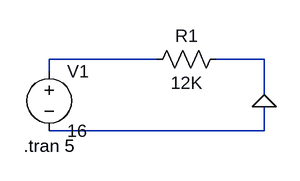
[diagram p0: schematic Draft3.asc]
Draft3.asc, the LTspice schematic file:
Version 4
SHEET 1 880 680
WIRE 80 192 -64 192
WIRE 224 192 160 192
WIRE -64 208 -64 192
WIRE 224 240 224 192
WIRE 224 288 224 256
WIRE 224 288 -64 288
FLAG 224 256 0
SYMBOL res 176 176 R90
WINDOW 0 0 56 VBottom 2
WINDOW 3 32 56 VTop 2
SYMATTR InstName R1
SYMATTR Value 12K
SYMBOL voltage -64 192 R0
WINDOW 123 0 0 Left 0
WINDOW 39 0 0 Left 0
SYMATTR InstName V1
SYMATTR Value 16
TEXT -98 308 Left 2 !.tran 5

The netlist it stands for:
* Draft3.asc
R1 N002 N001 12K
V1 N001 0 16
.tran 5
.backanno
.end